# EAGLE schematic ardReveil4_tiny10 (EAGLE 6.3)
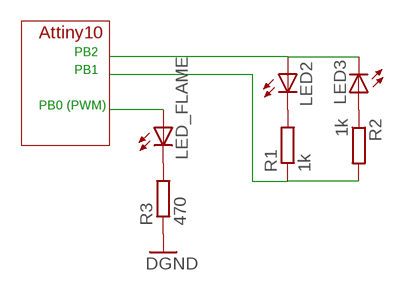
[diagram p0: schematic, sheet 1]

## Parts
LED2  TLLY4400  [LED3MM]
LED3  TLLY4400  [LED3MM]
LED_FLAME  TLLY4400  [LED3MM]
R1  1k  R-EU_0204/7  [0204/7]
R2  1k  R-EU_0204/7  [0204/7]
R3  470  R-EU_0204/7  [0204/7]

## Nets
GND: R3.1 ; supply symbol labelled DGND
N$1: LED2.A LED3.K(C)
N$2: LED2.K(C) R1.2
N$3: LED3.A R2.1
N$4: LED_FLAME.A
N$5: LED_FLAME.K(C) R3.2
N$6: R1.1 R2.2

## Notes on the sheet
- Attiny10
- PB2
- PB1
- PB0 (PWM)

## Library data of the parts
LED2 LED3 LED_FLAME = led:TLLY4400: Low Current (2mA) LED 3 mm Tinted Diffused Package color YELLOW Source: Data sheet <http://www.farnell.com/datasheets/391098.pdf>; MF: VISHAY SEMICONDUCTOR; OC_FARNELL: 1612439
R1-R3 = resistor:R-EU_: RESISTOR, European symbol